# EAGLE design CanBus-UP-Schalter-Teil2 (EAGLE 7.4.0)
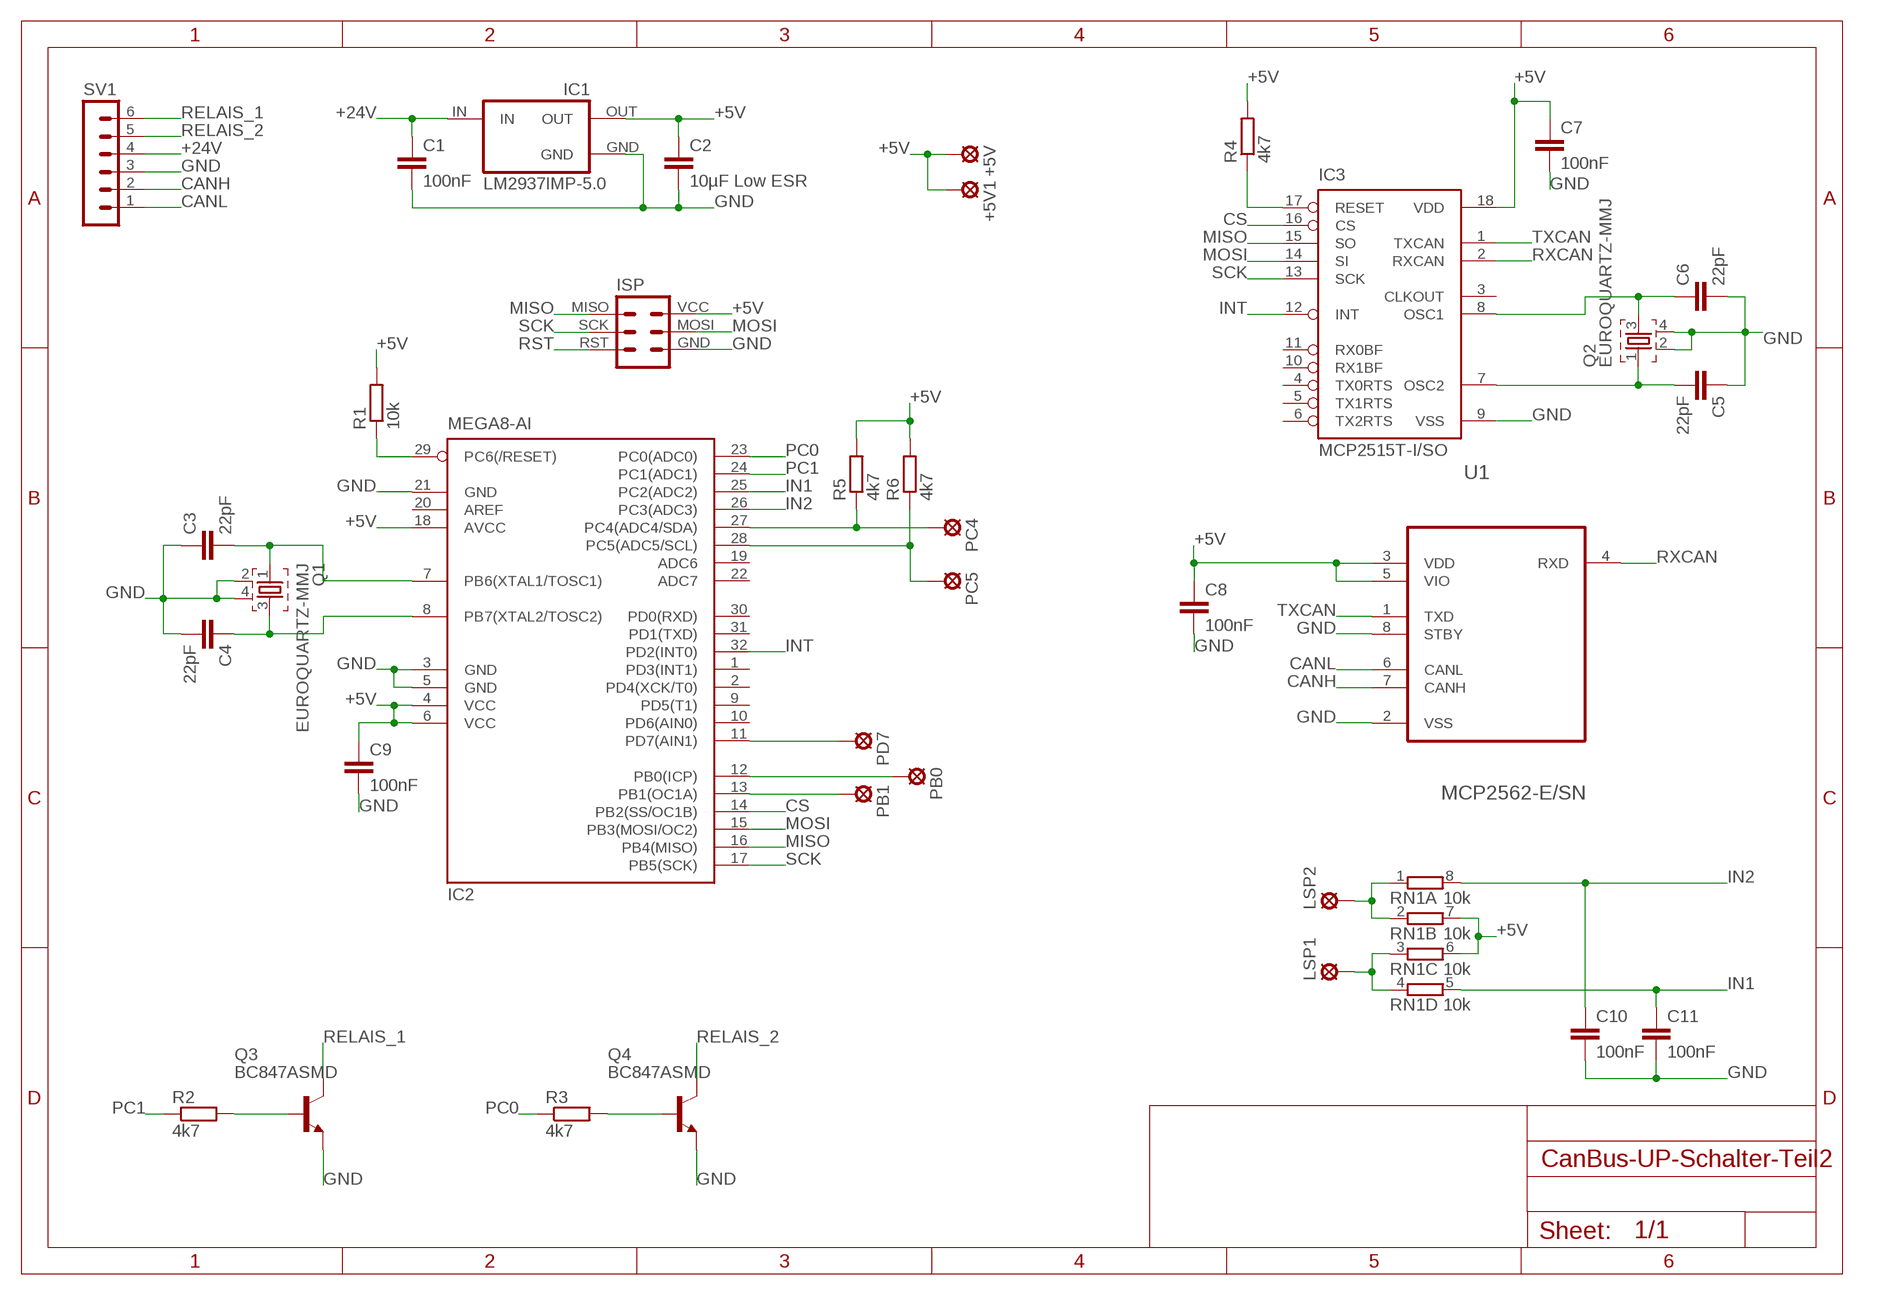
[diagram p0: schematic, sheet 1]

## Parts
+5V  LSP13  [LSP13]
+5V1  LSP13  [LSP13]
C1  100nF  C-EUC0805  [C0805]
C2  10µF Low ESR  C-EUC0805  [C0805]
C3  22pF  C-EUC0805  [C0805]
C4  22pF  C-EUC0805  [C0805]
C5  22pF  C-EUC0805  [C0805]
C6  22pF  C-EUC0805  [C0805]
C7  100nF  C-EUC0805  [C0805]
C8  100nF  C-EUC0805  [C0805]
C9  100nF  C-EUC0805  [C0805]
C10  100nF  C-EUC0805  [C0805]
C11  100nF  C-EUC0805  [C0805]
IC1  LM2937IMP-5.0  [SOT223]
IC2  MEGA8-AI  [TQFP32-08]
IC3  MCP2515T-I/SO  [SO18L]
ISP  ISPVIAS-ONLY-1.27MM  [ISP-VIAS-ONLY-1.27MM]
LSP1  LSP13  [LSP13]
LSP2  LSP13  [LSP13]
PB0  LSP13  [LSP13]
PB1  LSP13  [LSP13]
PC4  LSP13  [LSP13]
PC5  LSP13  [LSP13]
PD7  LSP13  [LSP13]
Q1  EUROQUARTZ-MMJ  [MJ-5X3.2]
Q2  EUROQUARTZ-MMJ  [MJ-5X3.2]
Q3  BC847ASMD  [SOT23]
Q4  BC847ASMD  [SOT23]
R1  10k  R-EU_R0805  [R0805]
R2  4k7  R-EU_R0805  [R0805]
R3  4k7  R-EU_R0805  [R0805]
R4  4k7  R-EU_R0805  [R0805]
R5  4k7  R-EU_R0805  [R0805]
R6  4k7  R-EU_R0805  [R0805]
RN1  10k  4R-N0603-ARC  [0603-ARC]
SV1  MA06-1  [MA06-1]
U1  MCP2562-E/SN  [SO08]

## Nets
+5V: +5V1.MP +5V.MP C2.1 C7.1 C8.1 C9.1 IC1.OUT IC2.4(VCC) IC2.6(VCC) IC2.18(AVCC) IC3.18(VDD) ISP.VCC R1.2 R4.2 R5.2 R6.2 RN1.6 RN1.7 U1.3(VDD) U1.5(VIO)
+24V: C1.1 IC1.IN SV1.4
CANH: SV1.2 U1.7(CANH)
CANL: SV1.1 U1.6(CANL)
CS: IC2.14(PB2(SS/OC1B)) IC3.16(CS)
GND: C1.2 C2.2 C3.1 C4.2 C5.1 C6.2 C7.2 C8.2 C9.2 C10.2 C11.2 IC1.GND IC2.3(GND) IC2.5(GND) IC2.21(GND) IC3.9(VSS) ISP.GND Q1.2 Q1.4 Q2.2 Q2.4 Q3.2(E) Q4.2(E) SV1.3 U1.2(VSS) U1.8(STBY)
IN1: C11.1 IC2.25(PC2(ADC2)) RN1.5
IN2: C10.1 IC2.26(PC3(ADC3)) RN1.8
INT: IC2.32(PD2(INT0)) IC3.12(INT)
MISO: IC2.16(PB4(MISO)) IC3.15(SO) ISP.MISO
MOSI: IC2.15(PB3(MOSI/OC2)) IC3.14(SI) ISP.MOSI
N$1: IC3.17(RESET) R4.1
N$2: Q3.1(B) R2.2
N$3: Q4.1(B) R3.2
N$5: LSP1.MP RN1.3 RN1.4
N$6: LSP2.MP RN1.1 RN1.2
N$7: IC2.13(PB1(OC1A)) PB1.MP
N$8: IC2.12(PB0(ICP)) PB0.MP
N$9: IC2.11(PD7(AIN1)) PD7.MP
N$10: IC2.28(PC5(ADC5/SCL)) PC5.MP R6.1
N$11: IC2.27(PC4(ADC4/SDA)) PC4.MP R5.1
PC0: IC2.23(PC0(ADC0)) R3.1
PC1: IC2.24(PC1(ADC1)) R2.1
RELAIS_1: Q3.3(C) SV1.6
RELAIS_2: Q4.3(C) SV1.5
RST: IC2.29(PC6(/RESET)) ISP.RST R1.1
RXCAN: IC3.2(RXCAN) U1.4(RXD)
SCK: IC2.17(PB5(SCK)) IC3.13(SCK) ISP.SCK
TXCAN: IC3.1(TXCAN) U1.1(TXD)
XTAL1: C3.2 IC2.7(PB6(XTAL1/TOSC1)) Q1.1
XTAL2: C4.1 IC2.8(PB7(XTAL2/TOSC2)) Q1.3
XTAL3: C5.2 IC3.7(OSC2) Q2.1
XTAL4: C6.1 IC3.8(OSC1) Q2.3
Unconnected: IC2.1(PD3(INT1)) IC2.2(PD4(XCK/T0)) IC2.9(PD5(T1)) IC2.10(PD6(AIN0)) IC2.19(ADC6) IC2.20(AREF) IC2.22(ADC7) IC2.30(PD0(RXD)) IC2.31(PD1(TXD)) IC3.3(CLKOUT) IC3.4(TX0RTS) IC3.5(TX1RTS) IC3.6(TX2RTS) IC3.10(RX1BF) IC3.11(RX0BF)

## Power pins joined to a net without a drawn wire
GND: IC1.GND@(GND)

## Library data of the parts
+5V +5V1 LSP1 LSP2 PB0 PB1 PC4 PC5 PD7 = solpad:LSP13: SOLDER PAD drill 1.3 mm, distributor Buerklin, 12H562
C1-C11 = rcl:C-EU: CAPACITOR, European symbol
IC1 = lm2937:LM2937IMP-*: 400 and 500 mA Low Dropout Voltage Regulator NATIONAL SEMICONDUCTOR created by Peter.Hofmann@ph-tronic.de <mailto:Reter.Hofmann@ph-tronic.de> 10-2004 Rev.0
IC2 = atmel:MEGA8: MICROCONTROLLER 8 Kbytes FLASH, 1 kbytes SRAM, 512 bytes EEPROM, USART, 6-channel 10 bit ADC, 2-channel 8 bit ADC Pin compatible with Atmega48, ATMega88, ATMega168 Source: avr.lbr; MPN: ATMEGA8-16AU; OC_FARNELL: 9171371; OC_NEWARK: 73M8863
IC3 = mcp2515_2551_2562:MCP2515
ISP = pogo-isp:ISP: ISP connector pads for Pogo ISP There are variants for mixed pads/vias, pads only and vias.
Q1 Q2 = crystal-smd:EUROQUARTZ-M*: Keramik-SMD-Quarz, 5x7x1,2mm EUROQUARTZ MQ2 Crystal, 4 pad Soruce: MQ <https://cdn-reichelt.de/documents/datenblatt/B400/MQ.pdf>, MJ <https://cdn-reichelt.de/documents/datenblatt/B400/MJ.pdf>; REICHELT: 16,000000-MJ
Q3 Q4 = transistor-npn:BC847*: NPN Transistor
R1-R6 = rcl:R-EU_: RESISTOR, European symbol
RN1 = resistor-dil:4R-N: Array Chip Resistor Source: RS Component / Phycomp; OC_FARNELL: unknown; OC_NEWARK: unknown
SV1 = con-lstb:MA06-1: PIN HEADER; OC_FARNELL: unknown; OC_NEWARK: unknown
U1 = mcp2515_2551_2562:MCP2562: High-Speed CAN Transceiver,DIP-8

## Board
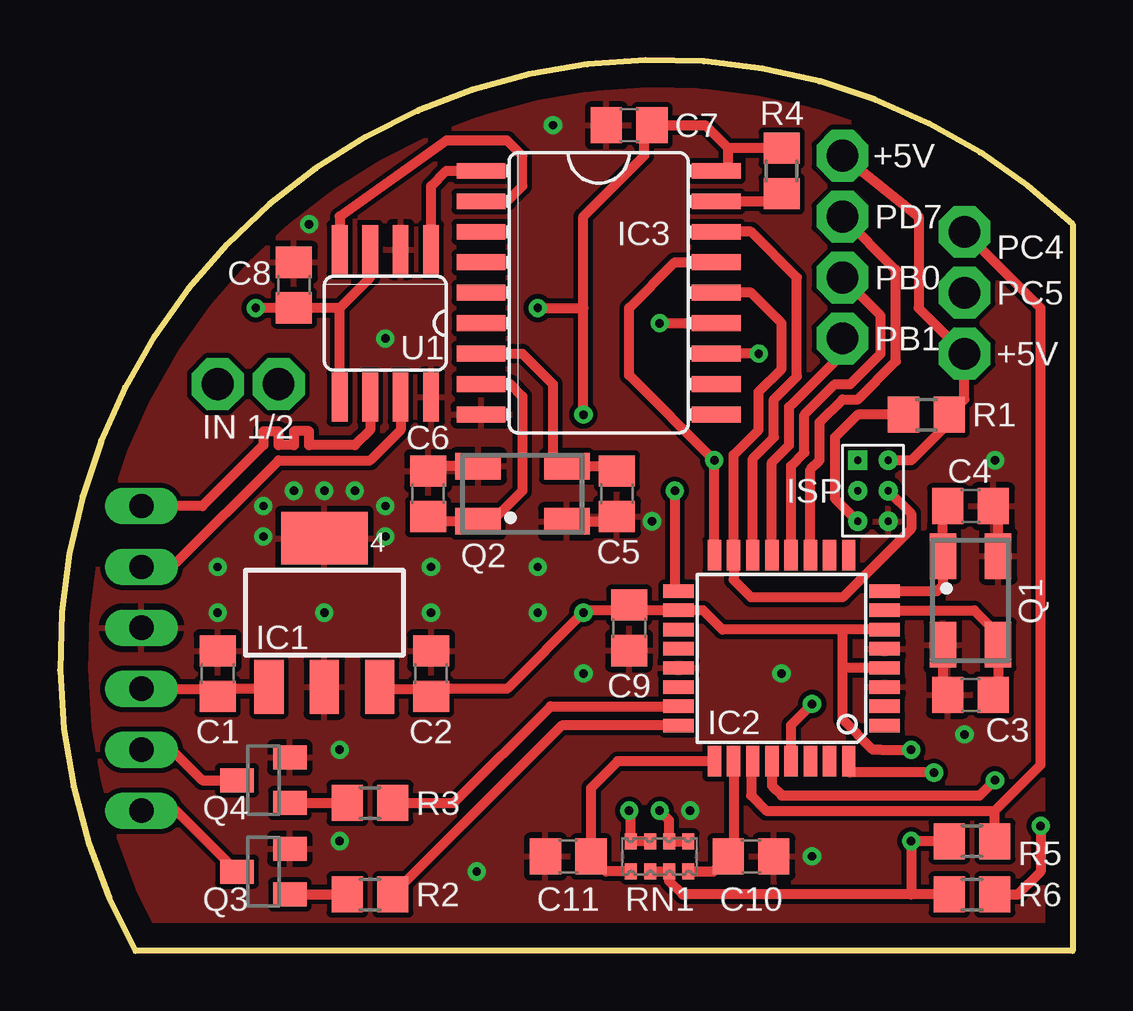
[diagram p1: board, top side]
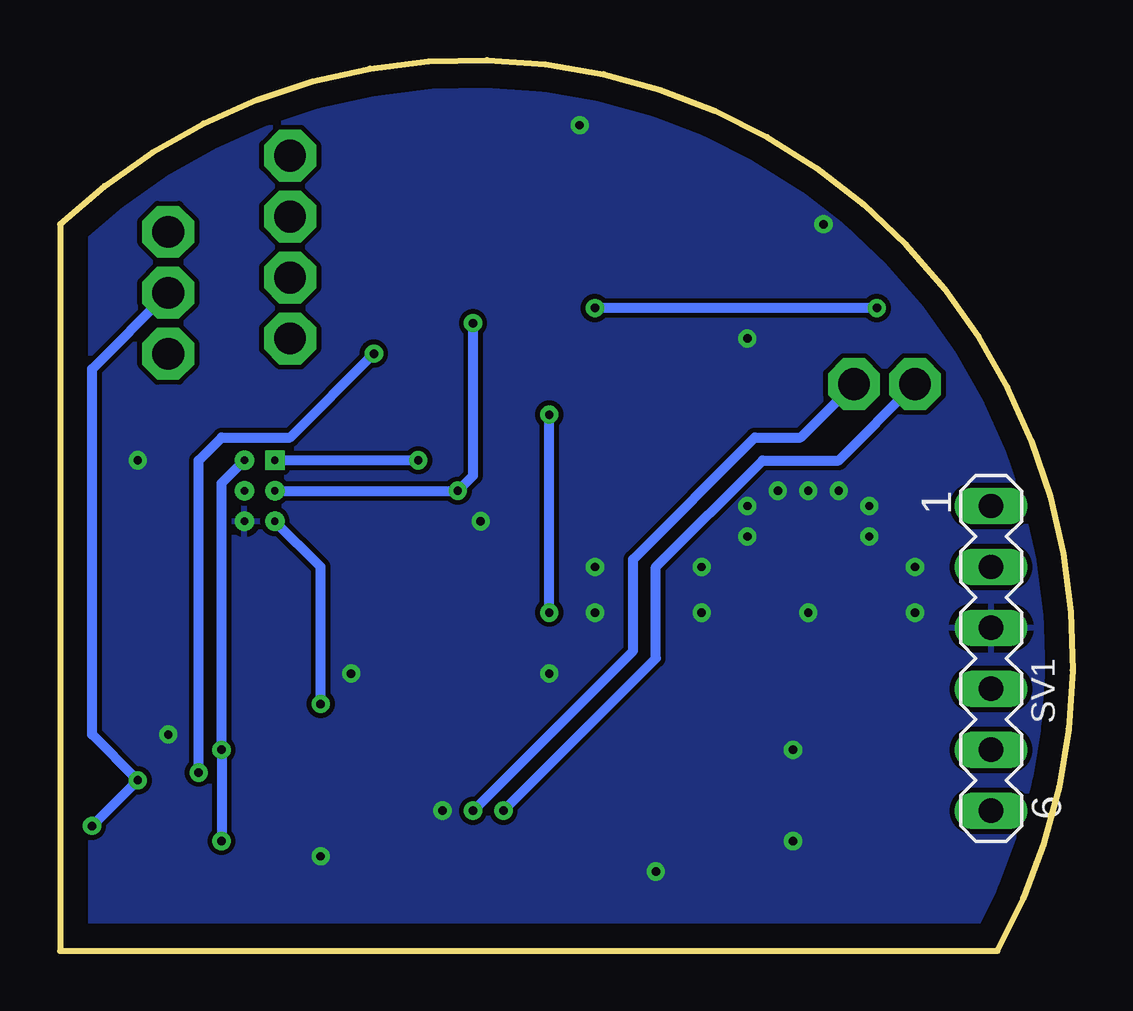
[diagram p2: board, bottom side, seen from below]

Size 42.19 x 37.14 mm. Coordinates in mm from the lower left corner, seen from the top.
Outline: 42.19,30.29 arc162 3.14,0 42.19,0 42.19,30.29
Copper layers (1*16): Top 0.035mm / dielectric 1.5mm / Bottom 0.035mm
Design rules "allpcb2 *": minimum track width 8mil, minimum drill 0.3mm, track to track 8mil, track to pad 8mil, pad to pad 8mil, via to via 8mil, smd to smd 6mil, copper to edge 40mil, drill to drill 8mil, minimum pad ring 10mil, minimum via ring 8mil, stop-mask expansion 0.1mm, vias tented up to drill 0.5mm, thermal gap 10mil

### Footprints (pad centres in the part's own frame; a part is rotated, then mirrored left to right if it is on the bottom)
LSP13 = drill 1.321 pad 2.159 octagon: MP 0,0
C0805 = smd 1.3 x 1.5: 1 -0.95,0; 2 0.95,0
SOT223 = smd 1.219 x 2.235: GND 0,-3.099; IN -2.311,-3.099; OUT 2.311,-3.099 | smd 3.6 x 2.2: GND@ 0,3.099
TQFP32-08 = smd 1.27 x 0.559: 1 -4.293,2.8; 2 -4.293,2; 3 -4.293,1.2; 4 -4.293,0.4; 5 -4.293,-0.4; 6 -4.293,-1.2; 7 -4.293,-2; 8 -4.293,-2.8; 17 4.293,-2.8; 18 4.293,-2; 19 4.293,-1.2; 20 4.293,-0.4; 21 4.293,0.4; 22 4.293,1.2; 23 4.293,2; 24 4.293,2.8 | smd 0.559 x 1.27: 9 -2.8,-4.293; 10 -2,-4.293; 11 -1.2,-4.293; 12 -0.4,-4.293; 13 0.4,-4.293; 14 1.2,-4.293; 15 2,-4.293; 16 2.8,-4.293; 25 2.8,4.293; 26 2,4.293; 27 1.2,4.293; 28 0.4,4.293; 29 -0.4,4.293; 30 -1.2,4.293; 31 -2,4.293; 32 -2.8,4.293
SO18L = smd 0.66 x 2.032: 1 -5.08,-4.902; 2 -3.81,-4.902; 3 -2.54,-4.902; 4 -1.27,-4.902; 5 0,-4.902; 6 1.27,-4.902; 7 2.54,-4.902; 8 3.81,-4.902; 9 5.08,-4.902; 10 5.08,4.902; 11 3.81,4.902; 12 2.54,4.902; 13 1.27,4.902; 14 0,4.902; 15 -1.27,4.902; 16 -2.54,4.902; 17 -3.81,4.902; 18 -5.08,4.902
ISP-VIAS-ONLY-1.27MM = drill 0.3 pad 0.762: GND 0.635,-1.27; MOSI 0.635,0; RST -0.635,-1.27; SCK -0.635,0; VCC 0.635,1.27 | drill 0.3 pad 0.762 square: MISO -0.635,1.27
MJ-5X3.2 = smd 1.9 x 1.1: 1 -1.85,-1.15; 2 1.85,-1.15; 3 1.85,1.15; 4 -1.85,1.15
SOT23 = smd 1 x 1.4: 1 -0.95,-1.1; 2 0.95,-1.1; 3 0,1.1
R0805 = smd 1.3 x 1.5: 1 -0.95,0; 2 0.95,0
0603-ARC = smd 0.5 x 0.65: 1 -1.2,-0.625; 2 -0.4,-0.625; 3 0.4,-0.625; 4 1.2,-0.625; 5 1.2,0.625; 6 0.4,0.625; 7 -0.4,0.625; 8 -1.2,0.625
MA06-1 = drill 1.016 long: 1 -6.35,0; 2 -3.81,0; 3 -1.27,0; 4 1.27,0; 5 3.81,0; 6 6.35,0
SO08 = smd 0.66 x 2.032: 1 -1.905,-3.073; 2 -0.635,-3.073; 3 0.635,-3.073; 4 1.905,-3.073; 5 1.905,3.073; 6 0.635,3.073; 7 -0.635,3.073; 8 -1.905,3.073

### Placement (x,y rotation side)
+5V  37.69,24.89 0 top
+5V1  32.61,33.15 0 top
C1  6.57,11.56 90 top
C2  15.46,11.56 90 top
C3  37.94,10.67 0 top
C4  37.94,18.54 0 top
C5  23.21,19.05 90 top
C6  15.33,19.05 90 top
C7  23.72,34.42 180 top
C8  9.75,27.75 90 top
C9  23.72,13.46 270 top
C10  28.8,3.94 0 top
C11  21.18,3.94 180 top
IC1  11.02,14.1 0 top
IC2  30.07,12.19 180 top
IC3  22.45,27.43 270 top
ISP  33.88,19.18 0 top
LSP1  6.57,23.62 0 top
LSP2  9.11,23.62 0 top
PB0  32.61,28.07 0 top
PB1  32.61,25.53 0 top
PC4  37.69,29.97 0 top
PC5  37.69,27.43 0 top
PD7  32.61,30.61 0 top
Q1  37.94,14.61 90 top
Q2  19.27,19.05 180 top
Q3  8.48,3.3 90 top
Q4  8.48,7.11 90 top
R1  36.1,22.35 0 top
R2  12.92,2.35 180 top
R3  12.92,6.16 180 top
R4  30.07,32.51 90 top
R5  38,4.57 180 top
R6  38,2.35 180 top
RN1  24.99,3.94 180 top
SV1  3.4,12.19 270 bottom
U1  13.56,26.16 180 top

### Tracks (layer width: path | path; a pad name or v marks a point on that pad's centre or on a via)
+5V  (via drill 0.35 pad 0.7)
  Top 0.406: IC1.OUT 13.53,10.79 13.66,10.92 15.15,10.92 C2.1 15.78,10.92 18.64,10.92 v21.81,14.1 21.91,14.19 23.72,14.19 C9.1 23.94,14.19 IC2.18 26.8,14.19 27.6,13.39 32.61,13.39 | IC2.6 32.61,13.39 | 27.85,33.46 26.89,34.42 C7.1 24.35,34.1 24.35,33.15 21.81,30.61 21.81,26.8 | R4.2 27.85,33.46 | IC3.18 27.85,32.51 27.85,33.46 | 11.65,26.8 12.92,28.07 U1.3 | v21.81,22.35 21.81,26.8 | v8.16,26.8 9.43,26.8 C8.1 10.07,27.11 10.38,26.8 11.65,26.8 | v19.91,26.8 21.81,26.8 | U1.5 11.65,26.8 | 32.61,11.79 32.61,9.65 33.87,8.38 34.19,8.38 v35.46,8.38 | 32.61,11.79 32.61,13.39 | IC2.4 32.61,11.79 | RN1.6 RN1.7 25.39,2.9 25.94,2.35 35.46,2.35 | ISP.VCC 35.46,20.45 37.05,22.03 R1.2 37.69,22.99 +5V.MP 35.78,26.8 35.78,30.61 +5V1.MP | 35.46,2.35 v35.46,4.57 R5.2 | R6.2 35.46,2.35
  Bottom 0.406: v21.81,14.1 v21.81,22.35 | v8.16,26.8 v19.91,26.8 | ISP.VCC 35.46,19.5 v35.46,8.38 v35.46,4.57
+24V
  Top 0.406: IC1.IN 8.5,10.79 8.37,10.92 6.89,10.92 C1.1 6.26,10.92 SV1.4
BOT
  pour Bottom: 5.3,4.89 5.3,0.44 3.4,0.44 3.4,4.89
CANH
  Top 0.406: U1.7 14.19,21.72 12.92,20.45 9.11,20.45 4.67,16 SV1.2
CANL
  Top 0.406: U1.6 12.92,21.72 12.29,21.08 10.38,21.08 10.38,21.66 9.75,21.66 9.75,21.08 9.11,21.08 9.11,21.67 8.48,21.67 8.48,21.08 5.94,18.54 SV1.1
CS
  Top 0.406: IC2.14 28.87,20.52 29.75,21.4 29.75,22.99 30.7,23.94 30.7,28.07 28.8,29.97 IC3.16
GND  (via drill 0.35 pad 0.7)
  Top 0.406: Q1.2 39.09,18.34 C4.2 | Q1.4 36.79,10.87 C3.1 | Q2.2 15.53,20.2 C6.2 | Q2.4 23.01,17.9 C5.1
  other vias: 37.69,9.02 13.56,25.53 10.38,30.29 30.07,11.56 24.67,17.91 13.56,17.27 13.56,18.54 12.29,19.18 11.02,19.18 9.75,19.18 8.48,18.54 8.48,17.27 20.54,34.42 6.57,16 6.57,14.1 15.46,16 15.46,14.1 11.65,8.38 11.65,4.57 11.02,14.1 17.37,3.3 19.91,16 19.91,14.1 21.81,11.56 31.34,3.94 38.96,20.45 26.26,5.84
  pour Bottom: -4.22,41.4 54.2,41.4 54.2,-17.02 -4.22,-17.02
  pour Top: -4.22,41.4 54.2,41.4 54.2,-17.02 -4.22,-17.02
IN1
  Top 0.406: RN1.5 22.75,3.31 C11.1 22.13,6.79 23.23,7.9 IC2.25
IN2
  Top 0.406: RN1.8 27.22,3.31 C10.1 28.07,4.16 IC2.26
INT  (via drill 0.35 pad 0.7)
  Top 0.406: v29.11,24.89 IC3.12 | v36.42,7.43 32.92,7.43 32.92,7.84 IC2.32
  Bottom 0.406: v29.11,24.89 32.61,21.4 35.46,21.4 36.42,20.45 v36.42,7.43
MISO  (via drill 0.35 pad 0.7)
  Top 0.406: IC3.15 25.62,28.7 23.72,26.8 23.72,24 v27.27,20.45 IC2.16
  Bottom 0.406: v27.27,20.45 ISP.MISO
MOSI
  Top 0.406: IC3.14 28.8,27.43 30.07,26.16 30.07,24.26 29.11,23.3 29.11,21.72 28.07,20.67 IC2.15 28.07,15.46 28.8,14.73 32.61,14.73 35.46,17.59 35.46,18.22 ISP.MOSI
N$1
  Top 0.406: IC3.17 29.75,31.24 R4.1
N$2
  Top 0.406: Q3.1 R2.2
N$3
  Top 0.406: Q4.1 R3.2
N$5  (via drill 0.35 pad 0.7)
  Top 0.406: RN1.3 RN1.4 23.79,5.77 v23.72,5.84
  Bottom 0.406: v23.72,5.84 17.37,12.19 17.37,16 12.92,20.45 9.75,20.45 LSP1.MP
N$6  (via drill 0.35 pad 0.7)
  Top 0.406: RN1.1 RN1.2 25.39,5.44 v24.99,5.84
  Bottom 0.406: v24.99,5.84 18.32,12.51 18.32,16.32 13.24,21.4 11.33,21.4 LSP2.MP
N$7
  Top 0.406: IC2.13 29.67,20.36 30.38,21.08 30.38,22.67 32.61,24.89 PB1.MP
N$8
  Top 0.406: IC2.12 30.47,20.21 31.02,20.76 31.02,22.35 32.29,23.62 32.92,23.62 34.19,24.89 34.19,26.48 PB0.MP
N$9
  Top 0.406: IC2.11 31.27,20.06 31.65,20.45 31.65,22.03 32.61,22.99 33.24,22.99 34.83,24.57 34.83,28.38 PD7.MP
N$10  (via drill 0.35 pad 0.7)
  Top 0.406: IC2.28 29.67,6.88 30.07,6.48 38.32,6.48 v38.96,7.11 | R6.1 39.91,2.35 40.86,3.3 v40.86,5.21
  Bottom 0.406: v40.86,5.21 v38.96,7.11 40.86,9.02 40.86,24.26 PC5.MP
N$11
  Top 0.406: 38.96,5.84 29.43,5.84 28.8,6.48 28.8,7.83 IC2.27 | R5.1 38.95,5.84 38.96,5.84 | 38.96,5.84 40.86,7.75 40.86,26.8 PC4.MP
PC0
  Top 0.406: R3.1 16.41,6.16 20.45,10.19 IC2.23
PC1
  Top 0.406: IC2.24 20.91,9.39 R2.1
RELAIS_1
  Top 0.406: SV1.6 4.84,5.84 Q3.3
RELAIS_2
  Top 0.406: SV1.5 4.67,8.38 5.94,7.11 Q4.3
RST  (via drill 0.35 pad 0.7)
  Top 0.406: IC2.29 30.47,9.42 v31.34,10.29 | R1.1 33.24,22.35 32.29,21.4 32.29,18.86 ISP.RST
  Bottom 0.406: v31.34,10.29 31.34,16 ISP.RST
RXCAN
  Top 0.406: IC3.2 18.64,31.24 19.27,31.88 19.27,33.15 18.64,33.78 16.1,33.78 11.65,30.61 U1.4
SCK  (via drill 0.35 pad 0.7)
  Top 0.406: v24.99,26.16 IC3.13 | v25.62,19.18 25.62,14.99 IC2.17
  Bottom 0.406: ISP.SCK v25.62,19.18 24.99,19.81 v24.99,26.16
TOP
  pour Top: 5.3,4.89 5.3,0.44 3.4,0.44 3.4,4.89
TXCAN
  Top 0.406: U1.1 15.46,31.88 16.1,32.51 IC3.1
XTAL1
  Top 0.406: IC2.7 38.1,14.19 38.96,13.34 38.96,12.89 Q1.1 39.09,10.87 C3.2
XTAL2
  Top 0.406: IC2.8 36.55,14.99 36.8,15.24 Q1.3 36.79,18.34 C4.1
XTAL3
  Top 0.406: IC3.7 19.27,24.89 20.54,23.62 20.54,20.45 20.81,20.45 Q2.1 23.01,20.2 C5.2
XTAL4
  Top 0.406: IC3.8 18.76,23.62 19.27,23.11 19.27,19.18 17.93,17.84 Q2.3 15.53,17.9 C6.1

### Text on the board
tNames: +5V | IN 1/2
tRestrict: TOP
bRestrict: BOT